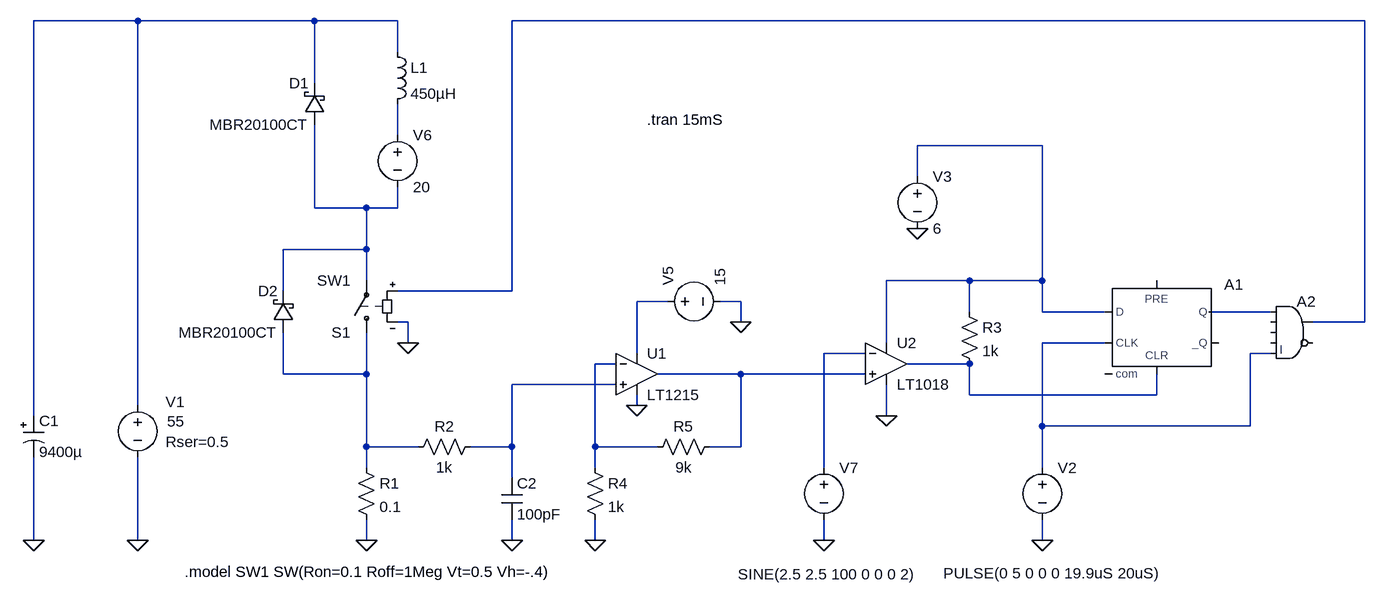
[diagram p0: schematic CURRENT PWM.asc]
CURRENT PWM.asc, the LTspice schematic file:
Version 4
SHEET 1 1868 772
WIRE -288 -432 -448 -432
WIRE -16 -432 -288 -432
WIRE 112 -432 -16 -432
WIRE 1600 -432 288 -432
WIRE 112 -384 112 -432
WIRE -16 -336 -16 -432
WIRE 112 -256 112 -304
WIRE 1104 -240 912 -240
WIRE 912 -192 912 -240
WIRE -16 -144 -16 -272
WIRE 64 -144 -16 -144
WIRE 112 -144 112 -176
WIRE 112 -144 64 -144
WIRE 64 -80 64 -144
WIRE 64 -80 -64 -80
WIRE 64 -32 64 -80
WIRE 992 -32 864 -32
WIRE 1104 -32 1104 -240
WIRE 1104 -32 992 -32
WIRE -64 -16 -64 -80
WIRE 288 -16 288 -432
WIRE 288 -16 112 -16
WIRE 528 0 480 0
WIRE 640 0 608 0
WIRE 992 16 992 -32
WIRE 1104 16 1104 -32
WIRE 1200 16 1104 16
WIRE 1456 16 1360 16
WIRE 128 32 112 32
WIRE 640 32 640 0
WIRE 1600 32 1600 -432
WIRE 1600 32 1520 32
WIRE 128 64 128 32
WIRE 864 64 864 -32
WIRE 1200 64 1104 64
WIRE 480 80 480 0
WIRE 832 80 768 80
WIRE 1456 80 1424 80
WIRE 448 96 416 96
WIRE 992 96 896 96
WIRE -64 112 -64 48
WIRE 64 112 64 48
WIRE 64 112 -64 112
WIRE 640 112 512 112
WIRE 832 112 640 112
WIRE 448 128 288 128
WIRE 992 144 992 96
WIRE 1280 144 1280 112
WIRE 1280 144 992 144
WIRE -288 160 -288 -432
WIRE 480 160 480 144
WIRE -448 176 -448 -432
WIRE 864 176 864 128
WIRE 1104 192 1104 64
WIRE 1424 192 1424 80
WIRE 1424 192 1104 192
WIRE 64 224 64 112
WIRE 144 224 64 224
WIRE 288 224 288 128
WIRE 288 224 224 224
WIRE 416 224 416 96
WIRE 512 224 416 224
WIRE 640 224 640 112
WIRE 640 224 592 224
WIRE 64 256 64 224
WIRE 416 256 416 224
WIRE 768 256 768 80
WIRE 1104 256 1104 192
WIRE 288 272 288 224
WIRE -448 368 -448 240
WIRE -288 368 -288 240
WIRE 64 368 64 336
WIRE 288 368 288 336
WIRE 416 368 416 336
WIRE 768 368 768 336
WIRE 1104 368 1104 336
FLAG 64 368 0
FLAG -288 368 0
FLAG 1104 368 0
FLAG 912 -112 0
FLAG 864 176 0
FLAG 288 368 0
FLAG 416 368 0
FLAG 480 160 0
FLAG 640 32 0
FLAG 128 64 0
FLAG 768 368 0
FLAG -448 368 0
SYMBOL ind 96 -400 R0
SYMATTR InstName L1
SYMATTR Value 450µH
SYMATTR SpiceLine Rser=0.68
SYMBOL res 48 240 R0
SYMATTR InstName R1
SYMATTR Value 0.1
SYMBOL schottky 0 -272 R180
WINDOW 0 24 64 Left 2
WINDOW 3 24 0 Left 2
SYMATTR InstName D1
SYMATTR Value MBR20100CT
SYMATTR Description Diode
SYMATTR Type diode
SYMBOL res 240 208 R90
WINDOW 0 0 56 VBottom 2
WINDOW 3 32 56 VTop 2
SYMATTR InstName R2
SYMATTR Value 1k
SYMBOL cap 272 272 R0
SYMATTR InstName C2
SYMATTR Value 100pF
SYMBOL Digital\\dflop 1280 -32 R0
WINDOW 3 0 0 Invisible 2
SYMATTR Value 5
SYMATTR InstName A1
SYMBOL voltage -288 144 R0
WINDOW 3 45 41 Left 2
WINDOW 123 0 0 Left 2
WINDOW 39 43 72 Left 2
WINDOW 0 43 11 Left 2
SYMATTR Value 55
SYMATTR SpiceLine Rser=0.5
SYMATTR InstName V1
SYMBOL voltage 1104 240 R0
WINDOW 123 0 0 Left 2
WINDOW 39 0 0 Left 2
WINDOW 3 -152 179 Left 2
SYMATTR Value PULSE(0 5 0 0 0 19.9uS 20uS)
SYMATTR InstName V2
SYMBOL voltage 912 -208 R0
WINDOW 123 0 0 Left 2
WINDOW 39 0 0 Left 2
SYMATTR InstName V3
SYMATTR Value 6
SYMBOL schottky -48 48 R180
WINDOW 0 24 64 Left 2
WINDOW 3 24 0 Left 2
SYMATTR InstName D2
SYMATTR Value MBR20100CT
SYMATTR Description Diode
SYMATTR Type diode
SYMBOL res 976 0 R0
SYMATTR InstName R3
SYMATTR Value 1k
SYMBOL Comparators\\LT1018 864 96 R0
SYMATTR InstName U2
SYMBOL sw 64 64 R180
SYMATTR InstName S1
SYMATTR Value SW1
SYMBOL Opamps\\LT1215 480 48 R0
SYMATTR InstName U1
SYMBOL res 400 240 R0
SYMATTR InstName R4
SYMATTR Value 1k
SYMBOL res 608 208 R90
WINDOW 0 0 56 VBottom 2
WINDOW 3 32 56 VTop 2
SYMATTR InstName R5
SYMATTR Value 9k
SYMBOL voltage 512 0 R270
WINDOW 123 0 0 Left 2
WINDOW 39 0 0 Left 2
SYMATTR InstName V5
SYMATTR Value 15
SYMBOL voltage 112 -272 R0
WINDOW 123 0 0 Left 2
WINDOW 39 0 0 Left 2
SYMATTR InstName V6
SYMATTR Value 20
SYMBOL Digital\\and 1488 -16 R0
SYMATTR InstName A2
SYMBOL voltage 768 240 R0
WINDOW 3 -132 180 Left 2
WINDOW 123 0 0 Left 2
WINDOW 39 0 0 Left 2
SYMATTR Value SINE(2.5 2.5 100 0 0 0 2)
SYMATTR InstName V7
SYMBOL polcap -464 176 R0
WINDOW 3 24 56 Left 2
SYMATTR Value 9400µ
SYMATTR InstName C1
SYMATTR Description Capacitor
SYMATTR Type cap
SYMATTR SpiceLine V=63 Irms=10 Rser=0.032 Lser=0
TEXT 496 -280 Left 2 !.tran 15mS
TEXT -216 416 Left 2 !.model SW1 SW(Ron=0.1 Roff=1Meg Vt=0.5 Vh=-.4)

The netlist it stands for:
* CURRENT PWM.asc
L1 N001 N003 450µH Rser=0.68
R1 N012 0 0.1
D1 N005 N001 MBR20100CT
R2 N014 N012 1k
C2 N014 0 100pF
A1 N004 0 N008 0 N011 0 N007 0 DFLOP 5
V1 N001 0 55 Rser=0.5
V2 N008 0 PULSE(0 5 0 0 0 19.9uS 20uS)
V3 N004 0 6
D2 N012 N005 MBR20100CT
R3 N004 N011 1k
XU2 N013 N009 N004 0 N011 LT1018  ; pins In+ In- V+ V- OUT
S1 N012 N005 N002 0 SW1
XU1 N014 N010 N006 0 N013 LT1215  ; pins In+ In- V+ V- OUT
R4 N010 0 1k
R5 N013 N010 9k
V5 N006 0 15
V6 N003 N005 20
A2 N007 0 0 0 N008 0 N002 0 AND
V7 N009 0 SINE(2.5 2.5 100 0 0 0 2)
C1 N001 0 9400µ V=63 Irms=10 Rser=0.032 Lser=0
.model D D
.lib standard.dio
.tran 15mS
.model SW1 SW(Ron=0.1 Roff=1Meg Vt=0.5 Vh=-.4)
.lib LTC1.lib
.lib LTC.lib
.backanno
.end